# Altium schematic sheet Fiber_interlock.SchDoc
size 420 x 297 mm; Address1: Address1; Address2: Address2; Address3: Address3; Address4: Address4; DocumentNumber: *Э3; SheetNumber: 5; SheetTotal: 15; DocumentType: Схема электрическая *
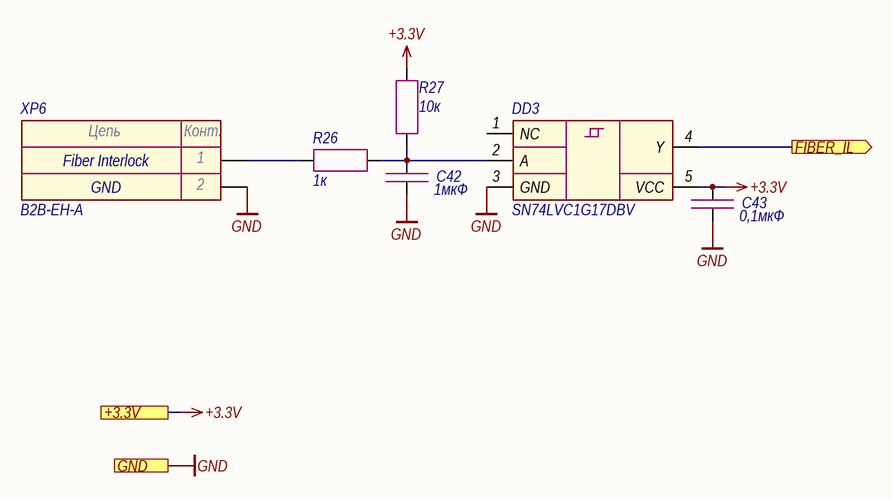
[diagram p0: Fiber_interlock.SchDoc]

## Parts
C42  1мкФ  [CAP_0603]
C43  0,1мкФ  [CAP_0603]
DD3  SN74LVC1G17DBV  [SOT-23-5]
R26  1к  [RES_0603]
R27  10к  [RES_0603]
XP6  B2B-EH-A  [B2B-EH-A]

## Ports
+3.3V (see Main[1C], Button[1D], Ethernet[3D], Flow_sensor[2C], Hardwiring[3D], LD_driver[1D], Power_supply[1D], Power_supply_CAN[1D], SF_driver[2C]), FIBER_IL (out, see Main[2C]), GND (see Main[1C], Button[1D], Column[1C], Ethernet[3D], Flow_sensor[2C], Guide_laser[1C], Hardwiring[3D], Indication[1C], LD_driver[1D], Power_supply[1D], Power_supply_CAN[1D], SF_driver[2D])

## Nets
+3.3V: C43.1 DD3.5(VCC) R27.2 ; port +3.3V
GND: C42.2 C43.2 DD3.3(GND) XP6.2 ; port GND
FIBER_IL: DD3.4(Y) ; port FIBER_IL
NetC42_1: C42.1 DD3.2(A) R26.2 R27.1
NetR26_1: R26.1 XP6.1

Not connected (* = marked no-connect by the designer): DD3 1(NC)

## Notes on the sheet
- (near XP6) Fiber Interlock
- GND
- Подп. и дата
- Инв. № дубл.
- Взам. инв. №
- Инв. № подл.
- Изм.
- Лист
- № докум.
- Подп.
- Дата
- Копировал
- Формат А3
- (in symbol Connector-2) Цепь; Конт.

## Library data of the parts
C42 = Capacitor: Manufacturer: Murata; Model: GRM188R61H105KAALD; Value: 1мкФ; Document: *
C43 = Capacitor: Manufacturer: Murata; Model: GRM188R71H104KA93D; Value: 0,1мкФ; Document: *
DD3 = SN74LVC1G17: Manufacturer: Texas Instruments; Model: SN74LVC1G17DBV; Document: *
R26 = Resistor: Manufacturer: Yageo; Model: RC0603FR-071KL; Value: 1к; Document: *
R27 = Resistor: Manufacturer: Yageo; Model: RC0603FR-0710KL; Value: 10к; Document: *
XP6 = Connector-2: Manufacturer: JST; Model: B2B-EH-A; Document: *